# EAGLE design fb3.21a_AK01 (EAGLE 4.16)
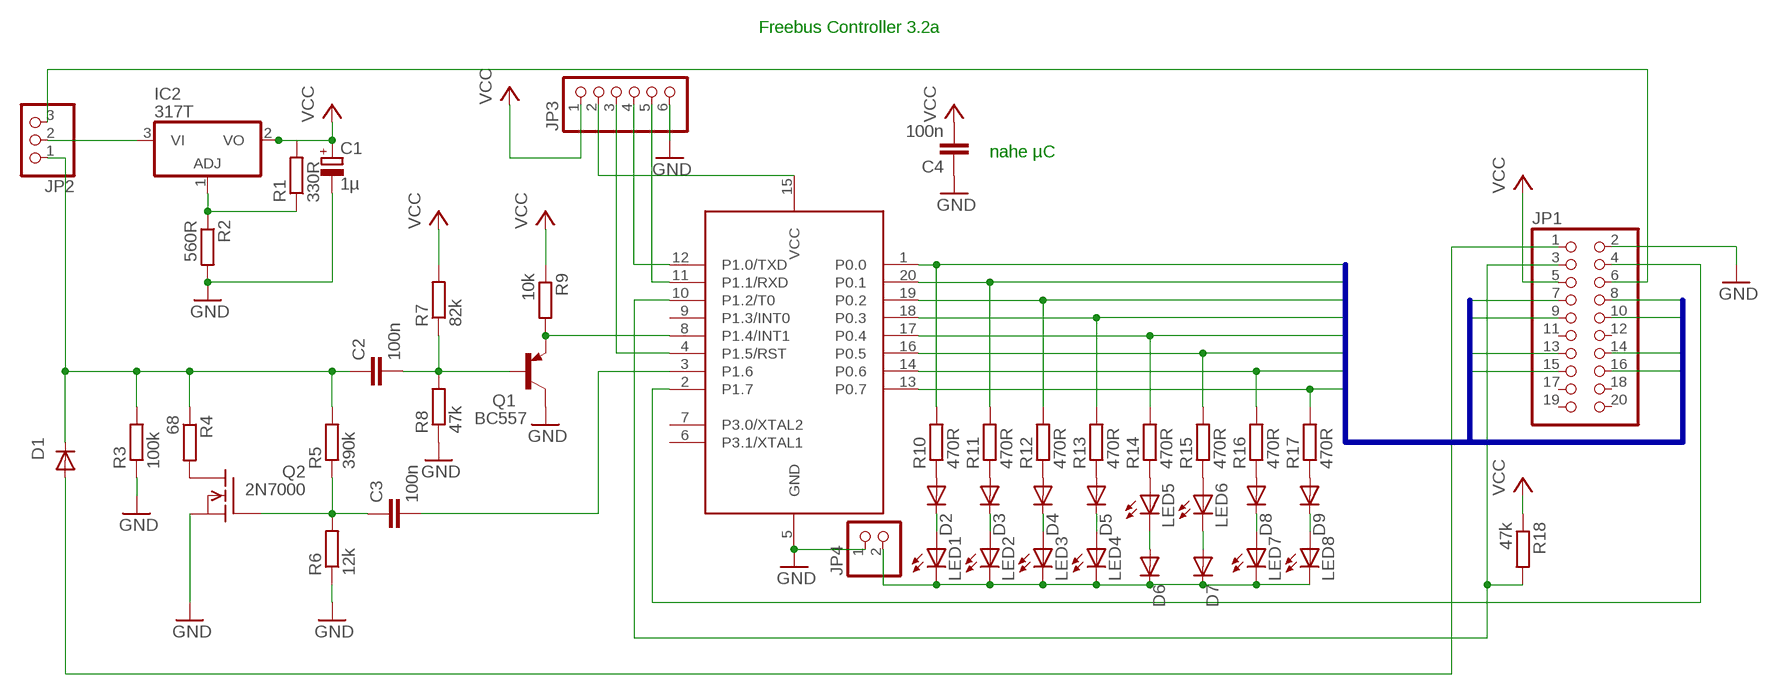
[diagram p0: schematic, sheet 1]

## Parts
C1  1µ  CPOL-EUE2.5-5  [E2,5-5]
C2  100n  C-EU050-024X044  [C050-024X044]
C3  100n  C-EU050-024X044  [C050-024X044]
C4  100n  C-EU050-024X044  [C050-024X044]
D1  1N4148  [DO35-10]
D2  1N4148  [DO35-10]
D3  1N4148  [DO35-10]
D4  1N4148  [DO35-10]
D5  1N4148  [DO35-10]
D6  1N4148  [DO35-10]
D7  1N4148  [DO35-10]
D8  1N4148  [DO35-10]
D9  1N4148  [DO35-10]
IC2  317T  [TO220H]
JP1  PINHD-2X10  [2X10]
JP2  PINHD-1X3  [1X03]
JP3  PINHD-1X6  [1X06]
JP4  PINHD-1X2  [1X02]
LED1  LED3MM  [LED3MM]
LED2  LED3MM  [LED3MM]
LED3  LED3MM  [LED3MM]
LED4  LED3MM  [LED3MM]
LED5  LED3MM  [LED3MM]
LED6  LED3MM  [LED3MM]
LED7  LED3MM  [LED3MM]
LED8  LED3MM  [LED3MM]
Q1  BC557  [TO92]
Q2  2N7000  VN2222KM  [TO237]
R1  330R  R-EU_0207/10  [0207/10]
R2  560R  R-EU_0207/10  [0207/10]
R3  100k  R-EU_0207/10  [0207/10]
R4  68  R-EU_0207/10  [0207/10]
R5  390k  R-EU_0207/10  [0207/10]
R6  12k  R-EU_0207/10  [0207/10]
R7  82k  R-EU_0207/10  [0207/10]
R8  47k  R-EU_0207/10  [0207/10]
R9  10k  R-EU_0207/10  [0207/10]
R10  470R  R-EU_0207/10  [0207/10]
R11  470R  R-EU_0207/10  [0207/10]
R12  470R  R-EU_0207/10  [0207/10]
R13  470R  R-EU_0207/10  [0207/10]
R14  470R  R-EU_0207/10  [0207/10]
R15  470R  R-EU_0207/5V  [0207/5V]
R16  470R  R-EU_0207/10  [0207/10]
R17  470R  R-EU_0207/10  [0207/10]
R18  47k  R-EU_0207/10  [0207/10]
U1  89LPC922  [DIL20]

## Nets
GND: C1.- C4.1 JP1.2 JP3.6 JP4.1 Q1.3(C) Q2.3(S) R2.2 R3.1 R6.1 R8.1 U1.5(GND)
LEDSELECT: D6.C D7.C JP4.2 LED1.K(C) LED2.K(C) LED3.K(C) LED4.K(C) LED7.K(C) LED8.K(C)
N$1: Q1.1(E) R9.2 U1.8(P1.4/INT1)
N$2: C2.2 Q1.2(B) R7.1 R8.2
N$3: D2.A R10.1
N$4: D3.A R11.1
N$5: C3.2 U1.3(P1.6)
N$6: Q2.1(D) R4.2
N$7: IC2.1(ADJ) R1.1 R2.1
N$8: D4.A R12.1
N$9: C2.1 D1.C JP2.1 R3.2 R4.1 R5.2
N$10: D5.A R13.1
N$11: IC2.3(VI) JP2.2
N$13: D8.A R16.1
N$14: D9.A R17.1
N$15: D2.C LED1.A
N$16: D1.A JP1.1
N$17: JP1.4 U1.2(P1.7)
N$19: JP1.6 JP2.3
N$20: D3.C LED2.A
N$21: D4.C LED3.A
N$22: D5.C LED4.A
N$23: D6.A LED5.K(C)
N$24: D7.A LED6.K(C)
N$25: D8.C LED7.A
N$26: D9.C LED8.A
N$27: LED5.A R14.1
N$29: JP3.4 U1.12(P1.0/TXD)
N$30: JP3.5 U1.11(P1.1/RXD)
N$31: JP3.3 U1.4(P1.5/RST)
N$32: JP3.2 U1.15(VCC)
N$33: JP1.3 R18.2 U1.10(P1.2/T0)
N$34: C3.1 Q2.2(G) R5.1 R6.2
N$35: LED6.A R15.1
P0.0: JP1.7 R10.2 U1.1(P0.0)
P0.1: JP1.8 R11.2 U1.20(P0.1)
P0.2: JP1.9 R12.2 U1.19(P0.2)
P0.3: JP1.10 R13.2 U1.18(P0.3)
P0.4: JP1.13 R14.2 U1.17(P0.4)
P0.5: JP1.14 R15.2 U1.16(P0.5)
P0.6: JP1.15 R16.2 U1.14(P0.6)
P0.7: JP1.16 R17.2 U1.13(P0.7)
VCC: C1.+ C4.2 IC2.2(VO) JP1.5 JP3.1 R1.2 R7.2 R9.1 R18.1
Unconnected: JP1.11 JP1.12 JP1.17 JP1.18 JP1.19 JP1.20 U1.6(P3.1/XTAL1) U1.7(P3.0/XTAL2) U1.9(P1.3/INT0)

## Buses
P0.[0..7]

## Notes on the sheet
- Freebus Controller 3.2a
- nahe µC

## Library data of the parts
C1 = rcl:CPOL-EU: POLARIZED CAPACITOR, European symbol
C2-C4 = rcl:C-EU: CAPACITOR, European symbol
D1-D9 = diode:1N4148: DIODE high speed (Philips)
IC2 = linear:*317: Positive VOLTAGE REGULATOR
JP1 = pinhead:PINHD-2X10: PIN HEADER
JP2 = pinhead:PINHD-1X3: PIN HEADER
JP3 = pinhead:PINHD-1X6: PIN HEADER
JP4 = pinhead:PINHD-1X2: PIN HEADER
LED1-LED8 = led:LED: LED OSRAM: - CHIPLED LG R971, LG N971, LY N971, LG Q971, LY Q971, LO R971, LY R971 LH N974, LH R974 LS Q976, LO Q976, LY Q976 LO Q996 - Hyper CHIPLED LW Q18S LB Q993, LB Q99A, LB R99A - SideLED LS A670, LO A670, LY A670, LG A670, LP A670 LB A673, LV A673, LT A673, LW A673 LH A674 LY A675 LS A676, LA A676, LO A676, LY A676, LW A676 LS A679, LY A679, LG A679 - Hyper Micro SIDELED® LS Y876, LA Y876, LO Y876, LY Y876 LT Y87S - SmartLED LW L88C, LW L88S LB L89C, LB L89S, LG L890 LS L89K, LO L89K, LY L89K LS L896, LA L896, LO L896, LY L896 - TOPLED LS T670, LO T670, LY T670, LG T670, LP T670 LSG T670, LSP T670, LSY T670, LOP T670, LYG T670 LG T671, LOG T671, LSG T671 LB T673, LV T673, LT T673, LW T673 LH T674 LS T676, LA T676, LO T676, LY T676, LB T676, LH T676, LSB T676, LW T676 LB T67C, LV T67C, LT T67C, LS T67K, LO T67K, LY T67K, LW E67C LS E67B, LA E67B, LO E67B, LY E67B, LB E67C, LV E67C, LT E67C LW T67C LS T679, LY T679, LG T679 LS T770, LO T770, LY T770, LG T770, LP T770 LB T773, LV T773, LT T773, LW T773 LH T774 LS E675, LA E675, LY E675, LS T675 LS T776, LA T776, LO T776, LY T776, LB T776 LHGB T686 LT T68C, LB T68C - Hyper Mini TOPLED® LB M676 - Mini TOPLED Santana® LG M470 LS M47K, LO M47K, LY M47K Source: http://www.osram.convergy.de - LUMILED® LXK2-PW12-R00, LXK2-PW12-S00, LXK2-PW14-U00, LXK2-PW14-V00 LXK2-PM12-R00, LXK2-PM12-S00, LXK2-PM14-U00 LXK2-PE12-Q00, LXK2-PE12-R00, LXK2-PE12-S00, LXK2-PE14-T00, LXK2-PE14-U00 LXK2-PB12-K00, LXK2-PB12-L00, LXK2-PB12-M00, LXK2-PB14-N00, LXK2-PB14-P00, LXK2-PB14-Q00 LXK2-PR12-L00, LXK2-PR12-M00, LXK2-PR14-Q00, LXK2-PR14-R00 LXK2-PD12-Q00, LXK2-PD12-R00, LXK2-PD12-S00 LXK2-PH12-R00, LXK2-PH12-S00 LXK2-PL12-P00, LXK2-PL12-Q00, LXK2-PL12-R00 Source: www.luxeon.com
Q1 = transistor-pnp:BC557: PNP Transistor
Q2 = transistor-fet:VN2222KM: N-Channel Enhancement MOSFET (VMOS); 60V; 0,5A; 7,5Ohm
R1-R18 = rcl:R-EU_: RESISTOR, European symbol
U1 = micro-philips:89LPC922

## Board
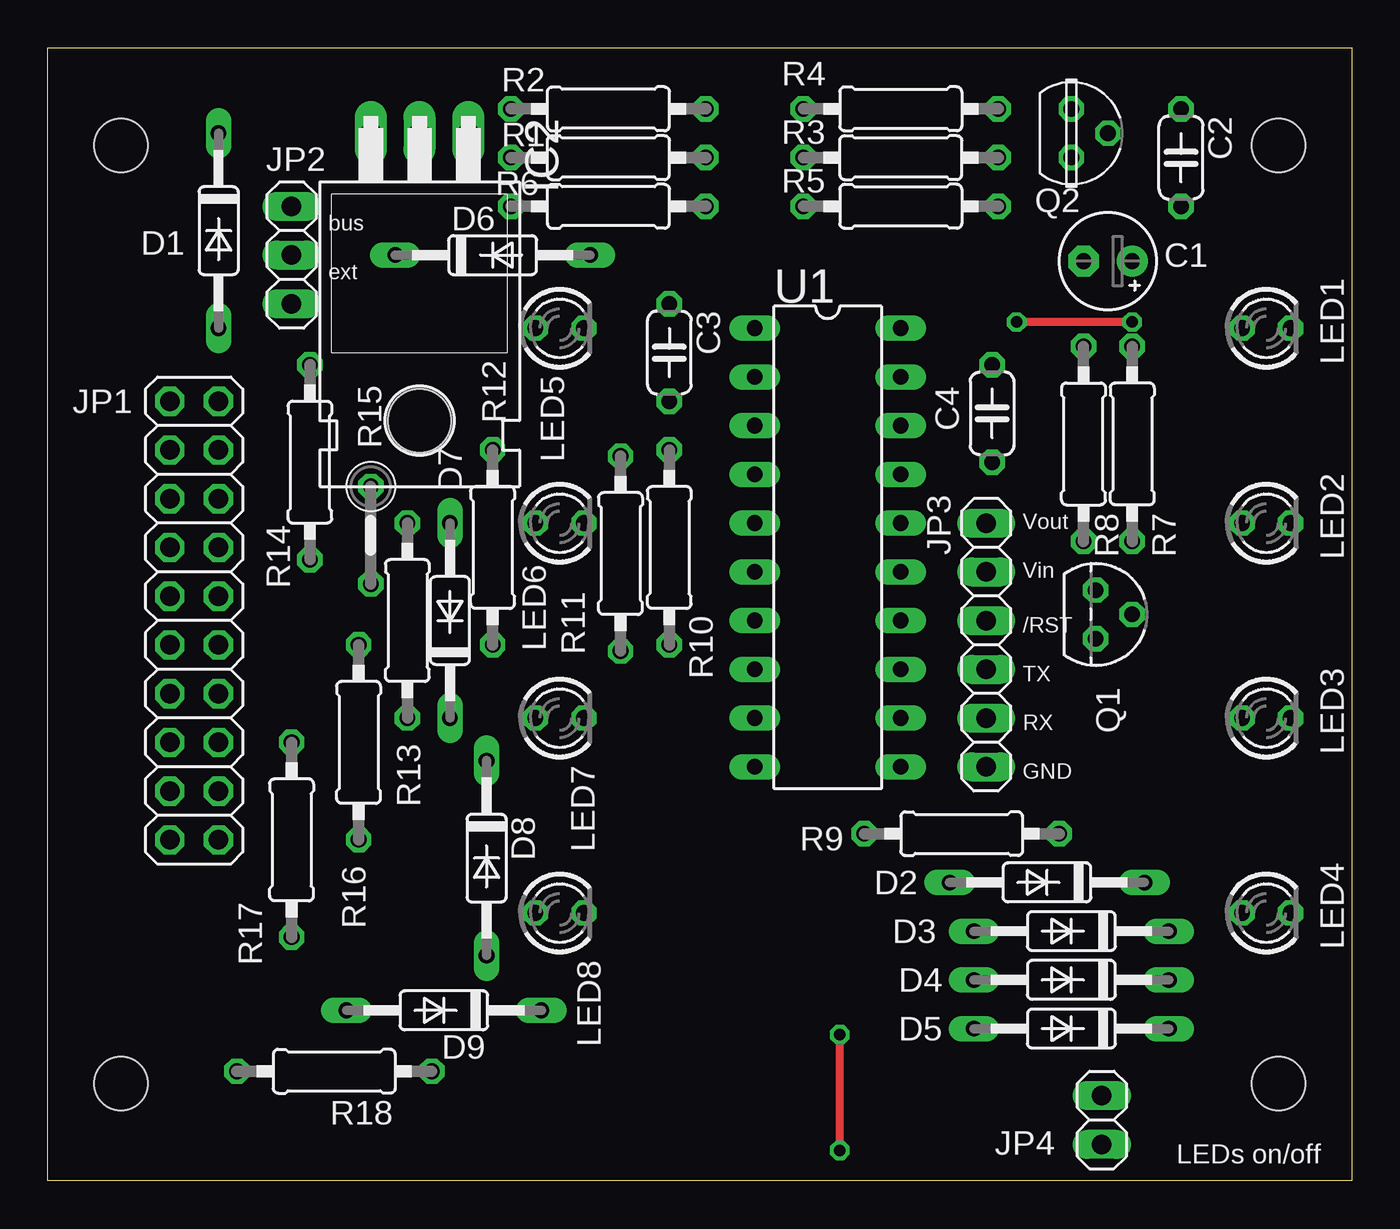
[diagram p1: board, top side]
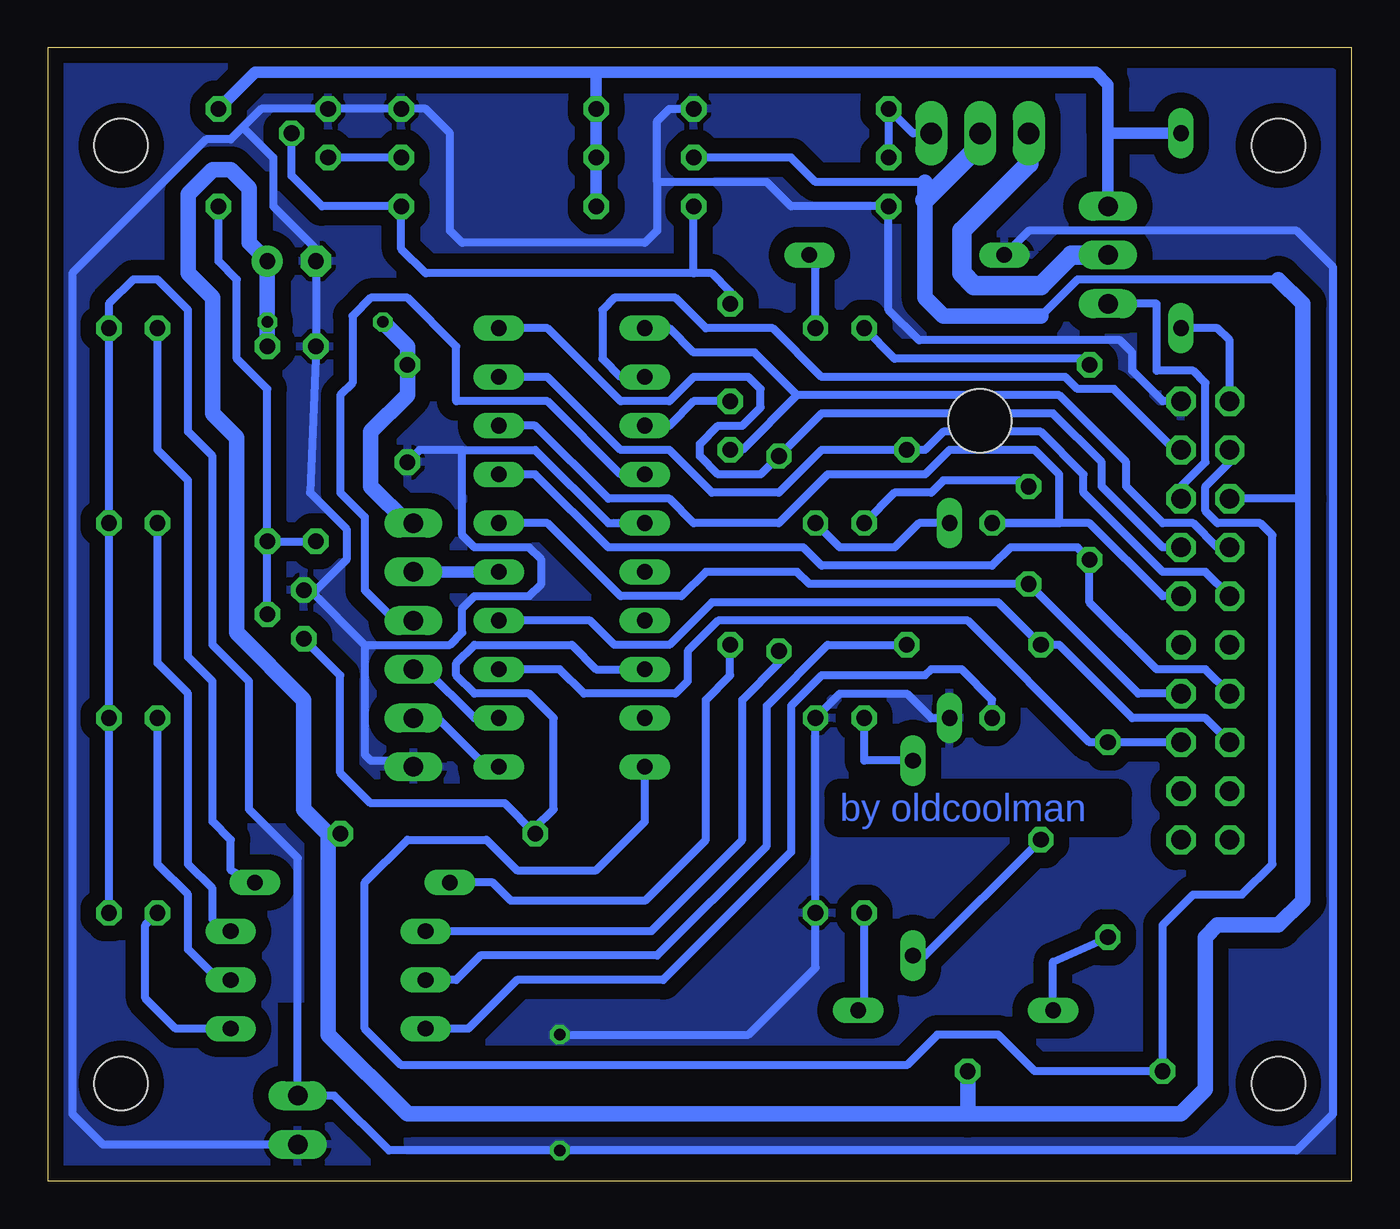
[diagram p2: board, bottom side, seen from below]

Size 67.94 x 59.05 mm. Coordinates in mm from the lower left corner, seen from the top.
Outline: 0,0 0,59.05 67.94,59.05 67.94,0 0,0
Copper layers (1*16): Top 0.035mm / dielectric 1.5mm / Bottom 0.035mm
Design rules "default": minimum track width 10mil, minimum drill 24mil, track to track 12mil, track to pad 12mil, pad to pad 12mil, via to via 12mil, smd to smd 8mil, copper to edge 20mil, drill to drill 8mil, minimum pad ring 10mil, minimum via ring 8mil, stop-mask expansion 4mil, vias tented up to drill 0mil, thermal gap 10mil
Holes 2.8 mm at 3.81,53.98 64.14,53.98 64.14,5.08 3.81,5.08

### Footprints (pad centres in the part's own frame; a part is rotated, then mirrored left to right if it is on the bottom)
E2,5-5 = drill 0.813 pad 1.6 round: + -1.27,0 | drill 0.813 pad 1.6 octagon: - 1.27,0
C050-024X044 = drill 0.813 octagon: 1 -2.54,0; 2 2.54,0
DO35-10 = drill 0.813 long: A 5.08,0; C -5.08,0
TO220H = drill 1.118 long: 1 -2.54,-10.16; 2 0,-10.16; 3 2.54,-10.16 | hole 3.302: 0,4.826
2X10 = drill 1.016 octagon: 1 -11.43,-1.27; 2 -11.43,1.27; 3 -8.89,-1.27; 4 -8.89,1.27; 5 -6.35,-1.27; 6 -6.35,1.27; 7 -3.81,-1.27; 8 -3.81,1.27; 9 -1.27,-1.27; 10 -1.27,1.27; 11 1.27,-1.27; 12 1.27,1.27; 13 3.81,-1.27; 14 3.81,1.27; 15 6.35,-1.27; 16 6.35,1.27; 17 8.89,-1.27; 18 8.89,1.27; 19 11.43,-1.27; 20 11.43,1.27
1X03 = drill 1.016 long: 1 -2.54,0; 2 0,0; 3 2.54,0
1X06 = drill 1.016 long: 1 -6.35,0; 2 -3.81,0; 3 -1.27,0; 4 1.27,0; 5 3.81,0; 6 6.35,0
1X02 = drill 1.016 long: 1 -1.27,0; 2 1.27,0
LED3MM = drill 0.813 octagon: A -1.27,0; K 1.27,0
TO92 = drill 0.813 octagon: 1 1.27,0; 2 0,1.905; 3 -1.27,0
TO237 = drill 0.813 octagon: 1 1.27,0; 2 0,1.905; 3 -1.27,0
0207/10 = drill 0.813 octagon: 1 -5.08,0; 2 5.08,0
0207/5V = drill 0.813 octagon: 1 -2.54,0; 2 2.54,0
DIL20 = drill 0.813 long: 1 -11.43,-3.81; 2 -8.89,-3.81; 3 -6.35,-3.81; 4 -3.81,-3.81; 5 -1.27,-3.81; 6 1.27,-3.81; 7 3.81,-3.81; 8 6.35,-3.81; 9 8.89,-3.81; 10 11.43,-3.81; 11 11.43,3.81; 12 8.89,3.81; 13 6.35,3.81; 14 3.81,3.81; 15 1.27,3.81; 16 -1.27,3.81; 17 -3.81,3.81; 18 -6.35,3.81; 19 -8.89,3.81; 20 -11.43,3.81

### Placement (x,y rotation side)
C1  55.24,47.94 180 top
C2  59.05,53.34 270 top
C3  32.38,43.18 270 top
C4  49.21,40.01 90 top
D1  8.89,49.53 270 top
D2  52.07,15.56 180 top
D3  53.34,13.02 180 top
D4  53.34,10.48 180 top
D5  53.34,7.94 180 top
D6  23.18,48.26 0 top
D7  20.95,29.21 90 top
D8  22.86,16.83 270 top
D9  20.64,8.89 180 top
IC2  19.37,44.45 180 top
JP1  7.62,29.21 270 top
JP2  12.7,48.26 270 top
JP3  48.9,27.94 270 top
JP4  54.93,3.17 90 top
LED1  63.5,44.45 0 top
LED2  63.5,34.29 0 top
LED3  63.5,24.13 0 top
LED4  63.5,13.97 0 top
LED5  26.67,44.45 0 top
LED6  26.67,34.29 0 top
LED7  26.67,24.13 0 top
LED8  26.67,13.97 0 top
Q1  54.61,29.53 270 top
Q2  53.34,54.61 270 top
R1  29.21,53.34 0 top
R2  29.21,55.88 0 top
R3  44.45,55.88 180 top
R4  44.45,53.34 0 top
R5  44.45,50.8 180 top
R6  29.21,50.8 0 top
R7  56.52,38.42 90 top
R8  53.98,38.42 270 top
R9  47.62,18.1 180 top
R10  32.38,33.02 90 top
R11  29.84,32.7 90 top
R12  23.18,33.02 90 top
R13  18.73,29.21 90 top
R14  13.65,37.47 270 top
R15  16.83,33.66 270 top
R16  16.19,22.86 90 top
R17  12.7,17.78 90 top
R18  14.92,5.71 180 top
U1  40.64,33.02 270 top

### Tracks (layer width: path | path; a pad name or v marks a point on that pad's centre or on a via)
GND
  Bottom 0.406: U1.5 38.73,34.29 42.55,38.1 46.35,38.1 | 56.83,55.88 Q2.3 R3.1 48.26,55.88 46.99,54.61 46.99,49.53 46.35,48.9 36.83,48.9 36.2,49.53 36.2,52.07 | 46.35,38.1 46.35,33.66 45.72,33.02 42.86,33.02 42.23,32.38 42.23,31.11 42.86,30.48 45.72,30.48 46.35,29.84 46.35,28.57 46.99,27.94 51.44,27.94 | C4.1 48.58,38.1 46.35,38.1 | R2.2 35.56,55.88 36.2,55.24 36.2,52.07 | 36.2,52.07 30.48,52.07 29.21,50.8 R6.1 24.13,45.4 22.54,43.81 12.06,43.81 11.43,43.18 11.43,42.23 9.84,40.64 JP1.2 | 56.83,55.88 57.78,54.93 56.2,53.34 56.2,50.8 53.98,48.58 C1.- R8.1 54.29,35.88 52.39,33.97 52.39,32.38 53.98,30.8 Q1.3 54.29,30.8 51.44,27.94 | JP3.6 49.21,21.91 51.12,21.91 51.44,22.23 51.44,27.94 | 56.83,55.88 58.42,54.29 59.69,54.29 66.67,47.31 66.67,3.49 65.09,1.91 JP4.1
  pour Bottom (isolate 0.813): 0.32,58.42 67.31,58.42 67.31,0.64 0.32,0.64 0.32,57.78
LEDSELECT  (via drill 0.6)
  Top 0.406: v41.27,1.59 v41.27,7.62
  Bottom 0.406: LED4.K LED3.K LED2.K LED1.K 64.77,45.72 63.5,46.99 62.23,46.99 60.64,45.4 60.64,39.05 59.37,37.78 59.37,27.94 57.47,26.04 57.47,19.37 54.93,16.83 JP4.2 53.02,4.45 50.16,1.59 v41.27,1.59 2.86,1.59 0.95,3.49 0.95,47.62 2.86,49.53 16.83,49.53 D6.C | D7.C 21.91,24.13 23.18,25.4 26.67,25.4 LED7.K LED8.K 27.94,11.11 31.43,7.62 v41.27,7.62
  pour Bottom (isolate 0.813): 0.95,57.78 22.23,57.78 22.23,41.91 42.23,41.91 42.23,18.41 58.74,18.41 58.74,9.53 49.21,9.53 49.21,1.59 0.64,1.59 0.95,37.15
N$1
  Bottom 0.406: U1.8 39.37,26.67 40.64,27.94 45.72,27.94 46.67,26.99 46.67,26.35 45.72,25.4 42.86,25.4 41.59,24.13 41.59,19.37 42.55,18.41 R9.2 44.13,19.68 51.12,19.68 52.7,21.27 52.7,26.35 Q1.1
N$2
  Bottom 0.406: R7.1 R8.2 R7.1 | Q1.2 R7.1 | R7.1 56.52,41.27 58.1,42.86 58.1,46.99 59.05,47.94 C2.2
N$3
  Bottom 0.406: R10.1 32.38,26.35 33.66,25.08 33.66,17.78 36.83,14.61 43.81,14.61 44.77,15.56 D2.A
N$4
  Bottom 0.406: R11.1 29.84,26.99 31.75,25.08 31.75,17.78 36.51,13.02 D3.A
N$5
  Bottom 0.406: C3.2 34.29,40.64 35.56,39.37 U1.3
N$6
  Bottom 0.406: R4.2 Q2.1
N$7
  Bottom 0.406: R1.1 R2.1 22.86,54.61 IC2.1
N$8
  Bottom 0.406: R12.1 27.3,27.94 30.48,24.77 30.48,17.46 36.2,11.75 45.4,11.75 46.67,10.48 D4.A
N$9
  Bottom 0.61: R5.2 R4.1 R3.2 39.37,57.78 | 12.7,54.61 JP2.1 | 12.7,54.61 12.7,57.15 13.34,57.78 39.37,57.78 | D1.C 12.7,54.61 | 39.37,57.78 57.15,57.78 C2.1
N$10
  Bottom 0.406: R13.1 18.73,25.08 20.32,26.67 21.91,26.67 22.23,26.35 27.62,26.35 29.21,24.77 29.21,17.14 35.88,10.48 43.5,10.48 46.04,7.94 D5.A
N$11
  Bottom 1.016: JP2.2 14.61,48.26 16.19,46.67 19.68,46.67 20.32,47.31 20.32,49.53 16.83,53.02 IC2.3
N$13
  Bottom 0.406: R16.1 22.23,11.75 D8.A
N$14
  Bottom 0.406: R17.1 15.56,11.43 D9.A
N$15
  Bottom 0.406: D2.C 58.42,16.19 58.42,17.78 59.37,18.73 59.37,26.04 60.64,27.3 60.64,36.51 62.23,38.1 LED1.A
N$16
  Bottom 0.406: JP1.1 6.35,43.81 6.99,44.45 D1.A
N$17
  Bottom 0.406: JP1.4 9.21,38.1 12.38,41.27 14.29,41.27 14.92,41.91 27.62,41.91 30.16,44.45 33.66,44.45 35.24,46.04 38.42,46.04 39.05,45.4 39.05,42.86 38.1,41.91 U1.2
N$19
  Bottom 0.406: JP1.6 8.89,36.2 7.62,37.47 7.62,41.59 8.26,42.23 10.16,42.23 10.16,45.72 JP2.3
N$20
  Bottom 0.406: D3.C 59.05,13.02 59.37,13.65 59.37,15.24 60.64,16.51 60.64,25.4 62.23,26.99 LED2.A
N$21
  Bottom 0.406: D4.C 59.05,10.48 60.64,12.06 60.64,14.92 62.23,16.51 LED3.A
N$22
  Bottom 0.406: LED4.A 62.87,13.34 62.87,9.53 61.28,7.94 D5.C
N$23
  Bottom 0.406: LED5.K 27.94,47.62 D6.A
N$24
  Bottom 0.406: D7.A 22.54,34.29 23.81,33.02 26.67,33.02 LED6.K
N$25
  Bottom 0.406: D8.C 25.4,21.91 LED7.A
N$26
  Bottom 0.406: D9.C 25.4,9.21 LED8.A
N$27
  Bottom 0.406: R14.1 13.97,42.86 23.81,42.86 LED5.A
N$29
  Bottom 0.406: U1.12 45.72,24.13 48.26,26.67 JP3.4
N$30
  Bottom 0.406: U1.11 45.09,21.59 47.62,24.13 JP3.5
N$31
  Bottom 0.406: U1.4 38.1,36.83 41.91,40.64 46.67,40.64 46.67,43.5 49.21,46.04 51.12,46.04 52.07,45.09 52.07,41.59 52.7,40.96 52.7,35.88 51.44,34.61 51.44,30.8 49.85,29.21 JP3.3
N$32
  Bottom 0.61: U1.15 JP3.2
N$33
  Bottom 0.406: JP1.3 6.35,37.47 7.62,36.2 7.62,34.92 6.99,34.29 4.76,34.29 4.13,33.66 4.13,16.51 5.71,14.92 8.26,14.92 9.84,13.34 R18.2 16.51,5.71 18.41,7.62 21.59,7.62 23.18,6.03 49.53,6.03 51.44,7.94 51.44,15.56 49.21,17.78 45.09,17.78 43.5,16.19 39.37,16.19 36.83,18.73 U1.10
N$34
  Bottom 0.406: Q2.2 55.24,52.39 53.66,50.8 R5.1 49.53,48.58 48.26,47.31 34.29,47.31 | 34.29,47.31 33.34,47.31 32.38,46.35 C3.1 | 34.29,47.31 R6.2
N$35
  Bottom 0.406: R15.1 17.14,36.51 21.27,36.51 21.91,35.88 23.81,35.88 LED6.A
P0.0
  Bottom 0.406: JP1.7 6.99,33.02 8.26,34.29 9.84,34.29 11.75,36.2 11.75,37.47 15.24,40.96 28.89,40.96 | U1.1 35.56,44.45 34.29,43.18 31.11,43.18 28.89,40.96 | R10.2 31.75,38.1 28.89,40.96
P0.1
  Bottom 0.406: JP1.8 9.84,33.02 13.02,36.2 13.02,37.47 15.56,40.01 27.62,40.01 R11.2 30.8,36.83 33.02,36.83 33.97,37.78 33.97,38.42 33.02,39.37 31.75,39.37 30.8,40.32 30.8,41.27 31.43,41.91 34.29,41.91 35.56,40.64 38.1,40.64 41.91,44.45 U1.20
P0.2
  Bottom 0.406: JP1.9 7.62,31.75 9.84,31.75 13.97,35.88 13.97,36.83 16.19,39.05 21.27,39.05 22.23,38.1 R12.2 27.62,38.1 29.84,35.88 33.34,35.88 35.56,38.1 38.1,38.1 41.91,41.91 U1.19
P0.3
  Bottom 0.406: JP1.10 9.84,30.48 13.65,34.29 R13.2 15.24,34.29 15.24,36.83 16.51,38.1 20.95,38.1 22.23,36.83 27.3,36.83 29.84,34.29 34.29,34.29 35.56,35.56 38.73,35.56 42.55,39.37 U1.18
P0.4
  Bottom 0.406: JP1.13 7.62,26.67 10.16,26.67 13.65,30.16 R14.2 14.29,33.02 17.78,33.02 18.73,32.07 27.62,32.07 28.57,33.02 38.73,33.02 42.55,36.83 U1.17
P0.5
  Bottom 0.406: JP1.14 11.11,25.4 R15.2 28.26,31.11 28.89,31.75 33.66,31.75 34.92,30.48 38.1,30.48 41.91,34.29 U1.16
P0.6
  Bottom 0.406: JP1.15 7.62,24.13 11.43,24.13 15.24,27.94 R16.2 18.41,30.16 33.34,30.16 35.56,27.94 38.42,27.94 39.69,29.21 U1.14
P0.7
  Bottom 0.406: JP1.16 R17.2 13.65,22.86 20,29.21 33.02,29.21 34.61,27.62 34.61,26.04 35.24,25.4 40.01,25.4 41.27,26.67 U1.13
VCC  (via drill 0.6)
  Top 0.406: v56.52,44.77 v50.48,44.77
  Bottom 0.406: 2.54,35.56 JP1.5 | 3.81,46.99 14.29,46.99 16.19,45.09 | R1.2 29.21,53.34 27.94,52.07 22.23,52.07 | 49.21,34.29 JP3.1 | 53.34,18.1 R9.1
  Bottom 0.813: 3.81,46.99 2.54,45.72 2.54,35.56 2.54,14.61 3.81,13.34 6.99,13.34 7.62,12.7 7.62,4.76 8.89,3.49 20,3.49 | 16.19,45.09 21.27,45.09 22.23,46.04 22.23,51.12 22.23,52.07 | R7.2 v56.52,44.77 C1.+ 57.47,48.9 57.47,51.75 58.42,52.7 59.37,52.7 60.64,51.44 60.64,47.31 59.37,46.04 59.37,40.01 58.1,38.73 58.1,28.57 54.61,25.08 54.61,19.37 53.34,18.1 53.34,7.62 49.21,3.49 20,3.49 | 20,3.49 R18.1 | 49.21,34.29 51.12,36.2 51.12,39.05 49.21,40.96 C4.2 49.21,43.5 v50.48,44.77
  Bottom 1.016: IC2.2 19.37,53.98 22.23,51.12

### Text on the board
Bottom: by oldcoolman
tPlace: bus | ext | Vout | Vin | /RST | TX | RX | GND | LEDs on/off